# Altium schematic sheet Uebersicht.SchDoc: SysP18_Team10: Uebersicht
size A4; CheckedBy: Kyburz Falk; Author: Michael Alig; CompanyName: NTB; Organization: NTB Interstate University of Applied; Address1: Werdenbergstrasse 4; Address3: 9471 Buchs; Address4: Switzerland; Revision: 14.03.2018; SheetNumber: 1; SheetTotal: 5; Organization1: Sciences of Technology Buchs; Size: A4; ShortDescription: Uebersicht Leistungselektronik
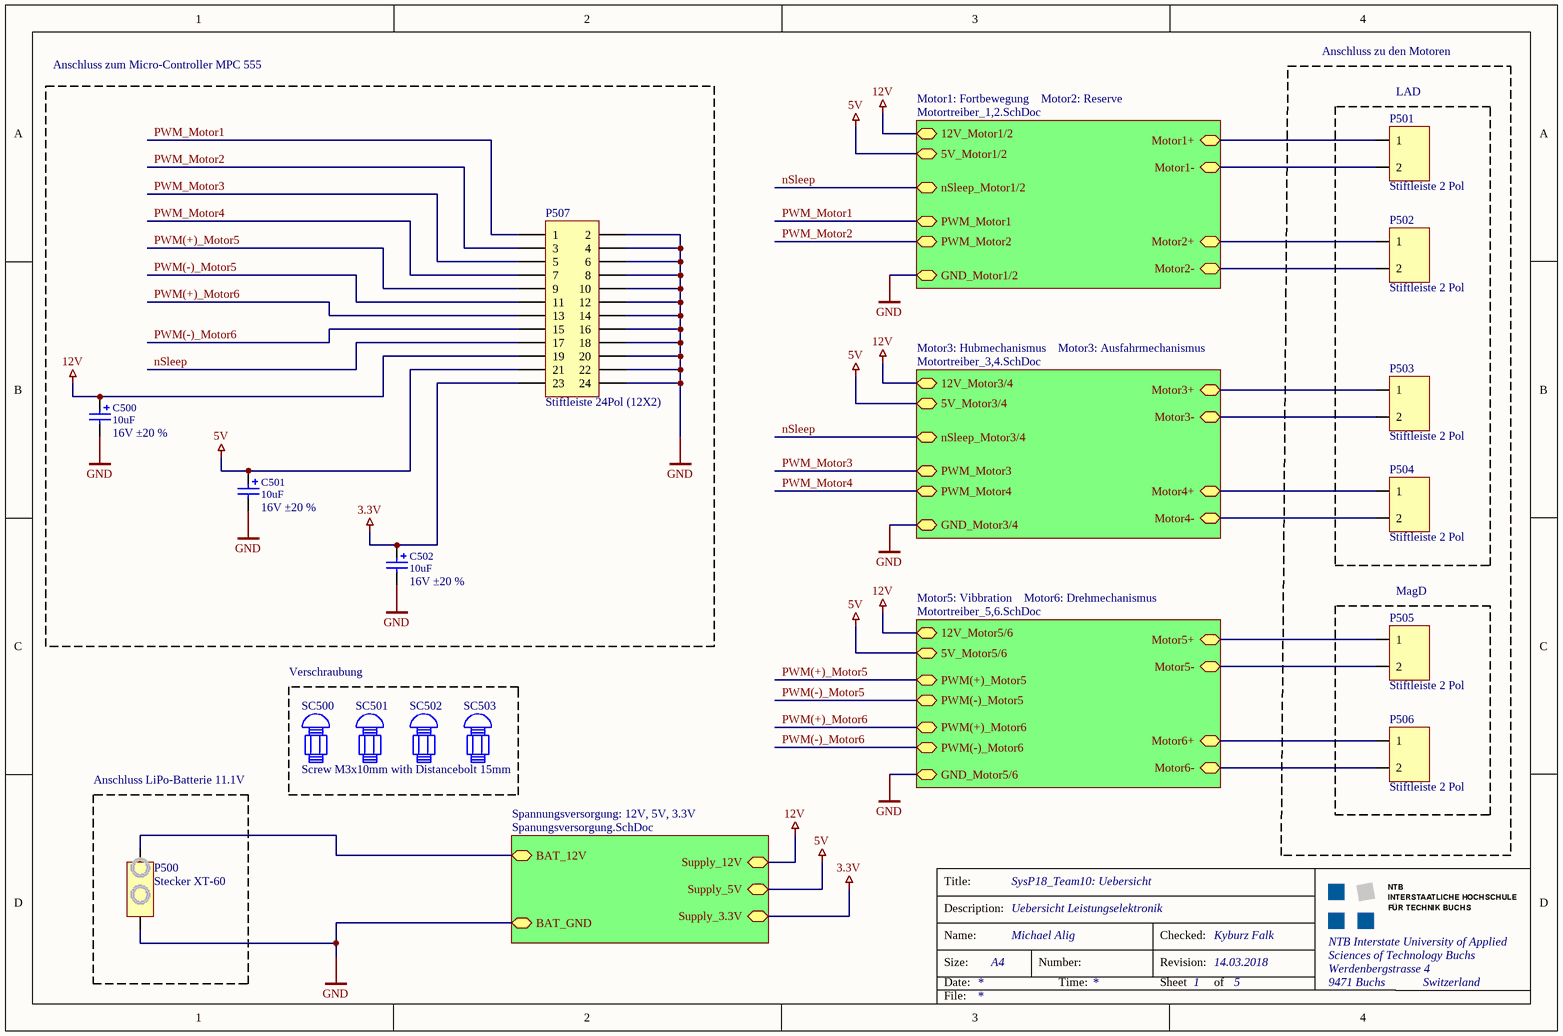
[diagram p0: Uebersicht.SchDoc]

## Parts
C500  value 10uF  ValueAddon: 16V ±20 %  [CDE_CAP AVE CODE D_H]  (hidden comment: AVE476M16D16T-F)
C501  value 10uF  ValueAddon: 16V ±20 %  [CDE_CAP AVE CODE D_H]  (hidden comment: AVE476M16D16T-F)
C502  value 10uF  ValueAddon: 16V ±20 %  [CDE_CAP AVE CODE D_H]  (hidden comment: AVE476M16D16T-F)
P500  Stecker XT-60  [Batteriestecker XT-60]
P501  Stiftleiste 2 Pol  [2Pin Header 2.54mm]
P502  Stiftleiste 2 Pol  [2Pin Header 2.54mm]
P503  Stiftleiste 2 Pol  [2Pin Header 2.54mm]
P504  Stiftleiste 2 Pol  [2Pin Header 2.54mm]
P505  Stiftleiste 2 Pol  [2Pin Header 2.54mm]
P506  Stiftleiste 2 Pol  [2Pin Header 2.54mm]
P507  Stiftleiste 24Pol (12X2)  [HDR2X12]
SC500  Screw M3x10mm with Distancebolt 15mm  [Screw_M3x10_Dist_15mm]
SC501  Screw M3x10mm with Distancebolt 15mm  [Screw_M3x10_Dist_15mm]  (value not drawn)
SC502  Screw M3x10mm with Distancebolt 15mm  [Screw_M3x10_Dist_15mm]  (value not drawn)
SC503  Screw M3x10mm with Distancebolt 15mm  [Screw_M3x10_Dist_15mm]  (value not drawn)

## Blocks framed on the sheet
Anschluss zum Micro-Controller MPC 555: C500-C502 P507
LAD: P501-P504
MagD: P505 P506
Anschluss LiPo-Batterie 11.1V: P500

## Sub-sheets
Motor1: Fortbewegung    Motor2: Reserve = Motortreiber_1,2.SchDoc: nSleep_Motor1/2, PWM_Motor2, Motor1+, Motor1-, PWM_Motor1, Motor2+, Motor2-, 12V_Motor1/2, GND_Motor1/2, 5V_Motor1/2
Motor3: Hubmechanismus    Motor3: Ausfahrmechanismus = Motortreiber_3,4.SchDoc: nSleep_Motor3/4, PWM_Motor4, Motor3+, Motor3-, PWM_Motor3, Motor4+, Motor4-, 12V_Motor3/4, GND_Motor3/4, 5V_Motor3/4
Motor5: Vibbration    Motor6: Drehmechanismus = Motortreiber_5,6.SchDoc: PWM(-)_Motor6, Motor5+, Motor5-, PWM(+)_Motor6, Motor6+, Motor6-, 12V_Motor5/6, GND_Motor5/6, 5V_Motor5/6, PWM(-)_Motor5, PWM(+)_Motor5
Spannungsversorgung: 12V, 5V, 3.3V = Spanungsversorgung.SchDoc: BAT_12V, BAT_GND, Supply_5V, Supply_3.3V, Supply_12V

## Nets
3.3V: C502.1(Pos) P507.23 ; sheet Spannungsversorgung: 12V, 5V, 3.3V/Supply_3.3V
5V: C501.1(Pos) P507.21 ; sheet Spannungsversorgung: 12V, 5V, 3.3V/Supply_5V, sheet Motor1: Fortbewegung    Motor2: Reserve/5V_Motor1/2, sheet Motor3: Hubmechanismus    Motor3: Ausfahrmechanismus/5V_Motor3/4, sheet Motor5: Vibbration    Motor6: Drehmechanismus/5V_Motor5/6
12V: C500.1(Pos) P507.19 ; sheet Spannungsversorgung: 12V, 5V, 3.3V/Supply_12V, sheet Motor1: Fortbewegung    Motor2: Reserve/12V_Motor1/2, sheet Motor3: Hubmechanismus    Motor3: Ausfahrmechanismus/12V_Motor3/4, sheet Motor5: Vibbration    Motor6: Drehmechanismus/12V_Motor5/6
GND: C500.2(Neg) C501.2(Neg) C502.2(Neg) P500.1 P507.2 P507.4 P507.6 P507.8 P507.10 P507.12 P507.14 P507.16 P507.18 P507.20 P507.22 P507.24 ; sheet Spannungsversorgung: 12V, 5V, 3.3V/BAT_GND, sheet Motor1: Fortbewegung    Motor2: Reserve/GND_Motor1/2, sheet Motor3: Hubmechanismus    Motor3: Ausfahrmechanismus/GND_Motor3/4, sheet Motor5: Vibbration    Motor6: Drehmechanismus/GND_Motor5/6
nSleep: P507.17 ; sheet Motor1: Fortbewegung    Motor2: Reserve/nSleep_Motor1/2, sheet Motor3: Hubmechanismus    Motor3: Ausfahrmechanismus/nSleep_Motor3/4
PWM(+)_Motor5: P507.9 ; sheet Motor5: Vibbration    Motor6: Drehmechanismus/PWM(+)_Motor5
PWM(+)_Motor6: P507.13 ; sheet Motor5: Vibbration    Motor6: Drehmechanismus/PWM(+)_Motor6
PWM(-)_Motor5: P507.11 ; sheet Motor5: Vibbration    Motor6: Drehmechanismus/PWM(-)_Motor5
PWM(-)_Motor6: P507.15 ; sheet Motor5: Vibbration    Motor6: Drehmechanismus/PWM(-)_Motor6
PWM_Motor1: P507.1 ; sheet Motor1: Fortbewegung    Motor2: Reserve/PWM_Motor1
PWM_Motor2: P507.3 ; sheet Motor1: Fortbewegung    Motor2: Reserve/PWM_Motor2
PWM_Motor3: P507.5 ; sheet Motor3: Hubmechanismus    Motor3: Ausfahrmechanismus/PWM_Motor3
PWM_Motor4: P507.7 ; sheet Motor3: Hubmechanismus    Motor3: Ausfahrmechanismus/PWM_Motor4
NetP500_2: P500.2 ; sheet Spannungsversorgung: 12V, 5V, 3.3V/BAT_12V
NetP501_1: P501.1 ; sheet Motor1: Fortbewegung    Motor2: Reserve/Motor1+
NetP501_2: P501.2 ; sheet Motor1: Fortbewegung    Motor2: Reserve/Motor1-
NetP502_1: P502.1 ; sheet Motor1: Fortbewegung    Motor2: Reserve/Motor2+
NetP502_2: P502.2 ; sheet Motor1: Fortbewegung    Motor2: Reserve/Motor2-
NetP503_1: P503.1 ; sheet Motor3: Hubmechanismus    Motor3: Ausfahrmechanismus/Motor3+
NetP503_2: P503.2 ; sheet Motor3: Hubmechanismus    Motor3: Ausfahrmechanismus/Motor3-
NetP504_1: P504.1 ; sheet Motor3: Hubmechanismus    Motor3: Ausfahrmechanismus/Motor4+
NetP504_2: P504.2 ; sheet Motor3: Hubmechanismus    Motor3: Ausfahrmechanismus/Motor4-
NetP505_1: P505.1 ; sheet Motor5: Vibbration    Motor6: Drehmechanismus/Motor5+
NetP505_2: P505.2 ; sheet Motor5: Vibbration    Motor6: Drehmechanismus/Motor5-
NetP506_1: P506.1 ; sheet Motor5: Vibbration    Motor6: Drehmechanismus/Motor6+
NetP506_2: P506.2 ; sheet Motor5: Vibbration    Motor6: Drehmechanismus/Motor6-

## Notes on the sheet
- Anschluss zu den Motoren
- Verschraubung
- Title:
- Description:
- Size:
- Date:
- Name:
- Number:
- Time:
- Revision:
- Sheet
- Checked:
- of
- File:

## Library data of the parts
C500-C502 = CDE_AVE476M16D16T-F_AVE CODE D: Aluminum Electrolytic Capacitors for Filtering and Bypass, 47uF, 16V; Manufacturer: Cornell Dubilier; #Class: PASSIVE; RefFootprint: CDE_CAP AVE CODE D; #ClassSub: CAPACITOR; Distributor PartNr: 598-AVE476M16D16T-F; Distributor: Mouser; Published: 20121220; Publisher: Stefan Ursella, M.Eng; ComponentLink1Description: Manufacturer Link; ComponentLink2Description: Datasheet; ComponentLink2URL: http://www.cde.com/catalogs/AVE.pdf; ComponentLink3Description: Packaging Specification; Manufacturer PartNr: AVE476M16D16T-F; RefFileFOO: *; RefFileSCH: *; RefSchema: CDE_AVE476M16D16T-F_AVE CODE D
P500 = Batteriestecker XT-60
P501-P506 = 2 Pin Connector: 2 Pin Header 2.54mm
P507 = Header 12X2: Header, 12-Pin, Dual row; LatestRevisionDate: 17-Jul-2002; LatestRevisionNote: Re-released for DXP Platform.; Publisher: Altium Limited
SC500-SC503 = Screw M3 10mm with Distancebolt 15mm